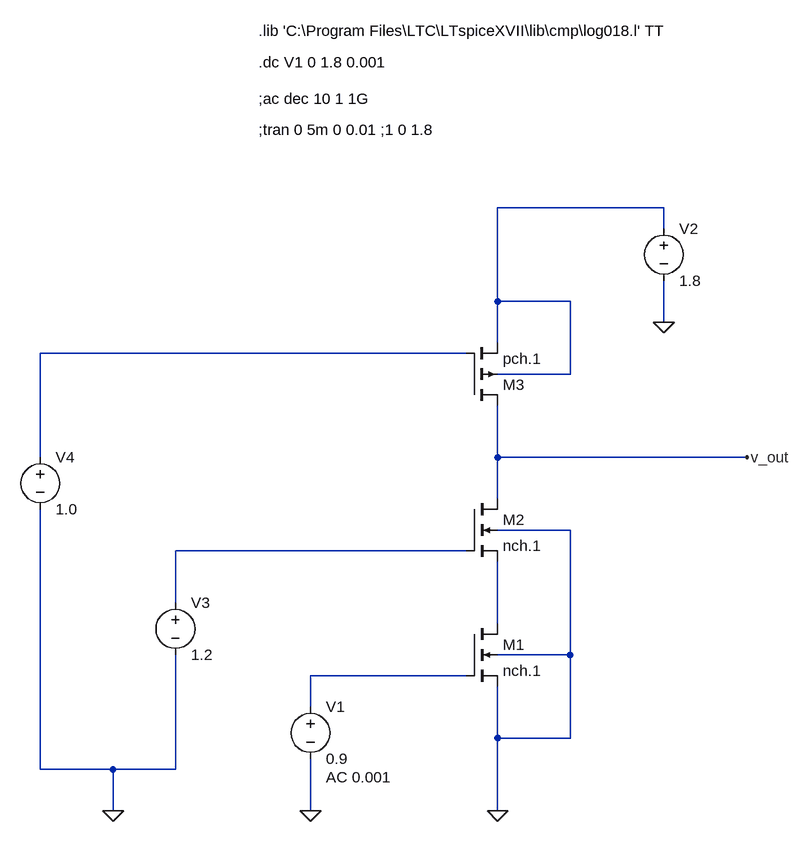
[diagram p0: schematic cascode-inverter.asc]
cascode-inverter.asc, the LTspice schematic file:
Version 4
SHEET 1 1668 1524
WIRE 288 176 32 176
WIRE 288 208 288 176
WIRE 32 320 32 176
WIRE 144 320 32 320
WIRE 288 352 288 288
WIRE 32 384 32 320
WIRE -16 400 -672 400
WIRE 144 432 144 320
WIRE 144 432 32 432
WIRE -672 560 -672 400
WIRE 32 560 32 480
WIRE 416 560 32 560
WIRE 32 624 32 560
WIRE 144 672 32 672
WIRE -16 704 -464 704
WIRE -464 784 -464 704
WIRE 32 816 32 720
WIRE 144 864 144 672
WIRE 144 864 32 864
WIRE -16 896 -256 896
WIRE -256 944 -256 896
WIRE 32 992 32 912
WIRE 144 992 144 864
WIRE 144 992 32 992
WIRE -672 1040 -672 640
WIRE -560 1040 -672 1040
WIRE -464 1040 -464 864
WIRE -464 1040 -560 1040
WIRE -560 1104 -560 1040
WIRE -256 1104 -256 1024
WIRE 32 1104 32 992
FLAG 32 1104 0
FLAG 288 352 0
FLAG 416 560 v_out
FLAG -256 1104 0
FLAG -560 1104 0
SYMBOL voltage 288 192 R0
WINDOW 123 0 0 Left 0
WINDOW 39 0 0 Left 0
SYMATTR InstName V2
SYMATTR Value 1.8
SYMBOL pmos4 -16 480 M180
SYMATTR InstName M3
SYMATTR Value pch.1
SYMATTR Value2 l=0.18u w=0.3u
SYMBOL nmos4 -16 816 R0
SYMATTR InstName M1
SYMATTR Value nch.1
SYMATTR Value2 l=0.18u w=1u
SYMBOL voltage -256 928 R0
WINDOW 123 24 124 Left 2
WINDOW 39 0 0 Left 0
SYMATTR Value2 AC 0.001
SYMATTR InstName V1
SYMATTR Value 0.9
SYMBOL nmos4 -16 624 R0
SYMATTR InstName M2
SYMATTR Value nch.1
SYMATTR Value2 l=0.18u w=2u
SYMBOL voltage -464 768 R0
WINDOW 123 0 0 Left 0
WINDOW 39 0 0 Left 0
SYMATTR InstName V3
SYMATTR Value 1.2
SYMBOL voltage -672 544 R0
WINDOW 123 0 0 Left 0
WINDOW 39 0 0 Left 0
SYMATTR InstName V4
SYMATTR Value 1.0
TEXT -336 -96 Left 2 !.lib 'C:\\Program Files\\LTC\\LTspiceXVII\\lib\\cmp\\log018.l' TT
TEXT -336 8 Left 2 !;ac dec 10 1 1G
TEXT -336 -48 Left 2 !.dc V1 0 1.8 0.001
TEXT -336 56 Left 2 !;tran 0 5m 0 0.01 ;1 0 1.8

The netlist it stands for:
* cascode-inverter.asc
V2 N001 0 1.8
M3 v_out N002 N001 N001 pch.1 l=0.18u w=0.3u
M1 N004 N005 0 0 nch.1 l=0.18u w=1u
V1 N005 0 0.9 AC 0.001
M2 v_out N003 N004 0 nch.1 l=0.18u w=2u
V3 N003 0 1.2
V4 N002 0 1.0
.model NMOS NMOS
.model PMOS PMOS
.lib standard.mos
.lib 'C:\Program Files\LTC\LTspiceXVII\lib\cmp\log018.l' TT
;ac dec 10 1 1G
.dc V1 0 1.8 0.001
;tran 0 5m 0 0.01 ;1 0 1.8
.backanno
.end

* Results of the author's LTspice run, read from the files saved beside the schematic
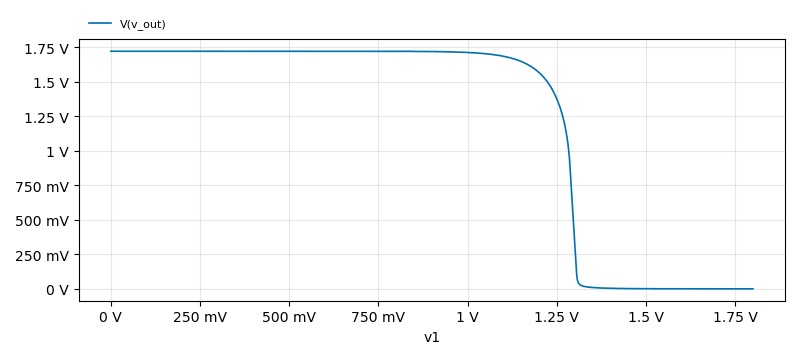
[diagram p1: DC transfer characteristic of cascode-inverter.asc, plotted from the saved traces]
* DC transfer characteristic, 1 run:
*   V(v_out): 1.72 V at v1=0 V, 16.7 µV at v1=1.8 V, min 16.7 µV, max 1.72 V